# EAGLE design CorrienteTestMaquina (EAGLE 9.6.2)
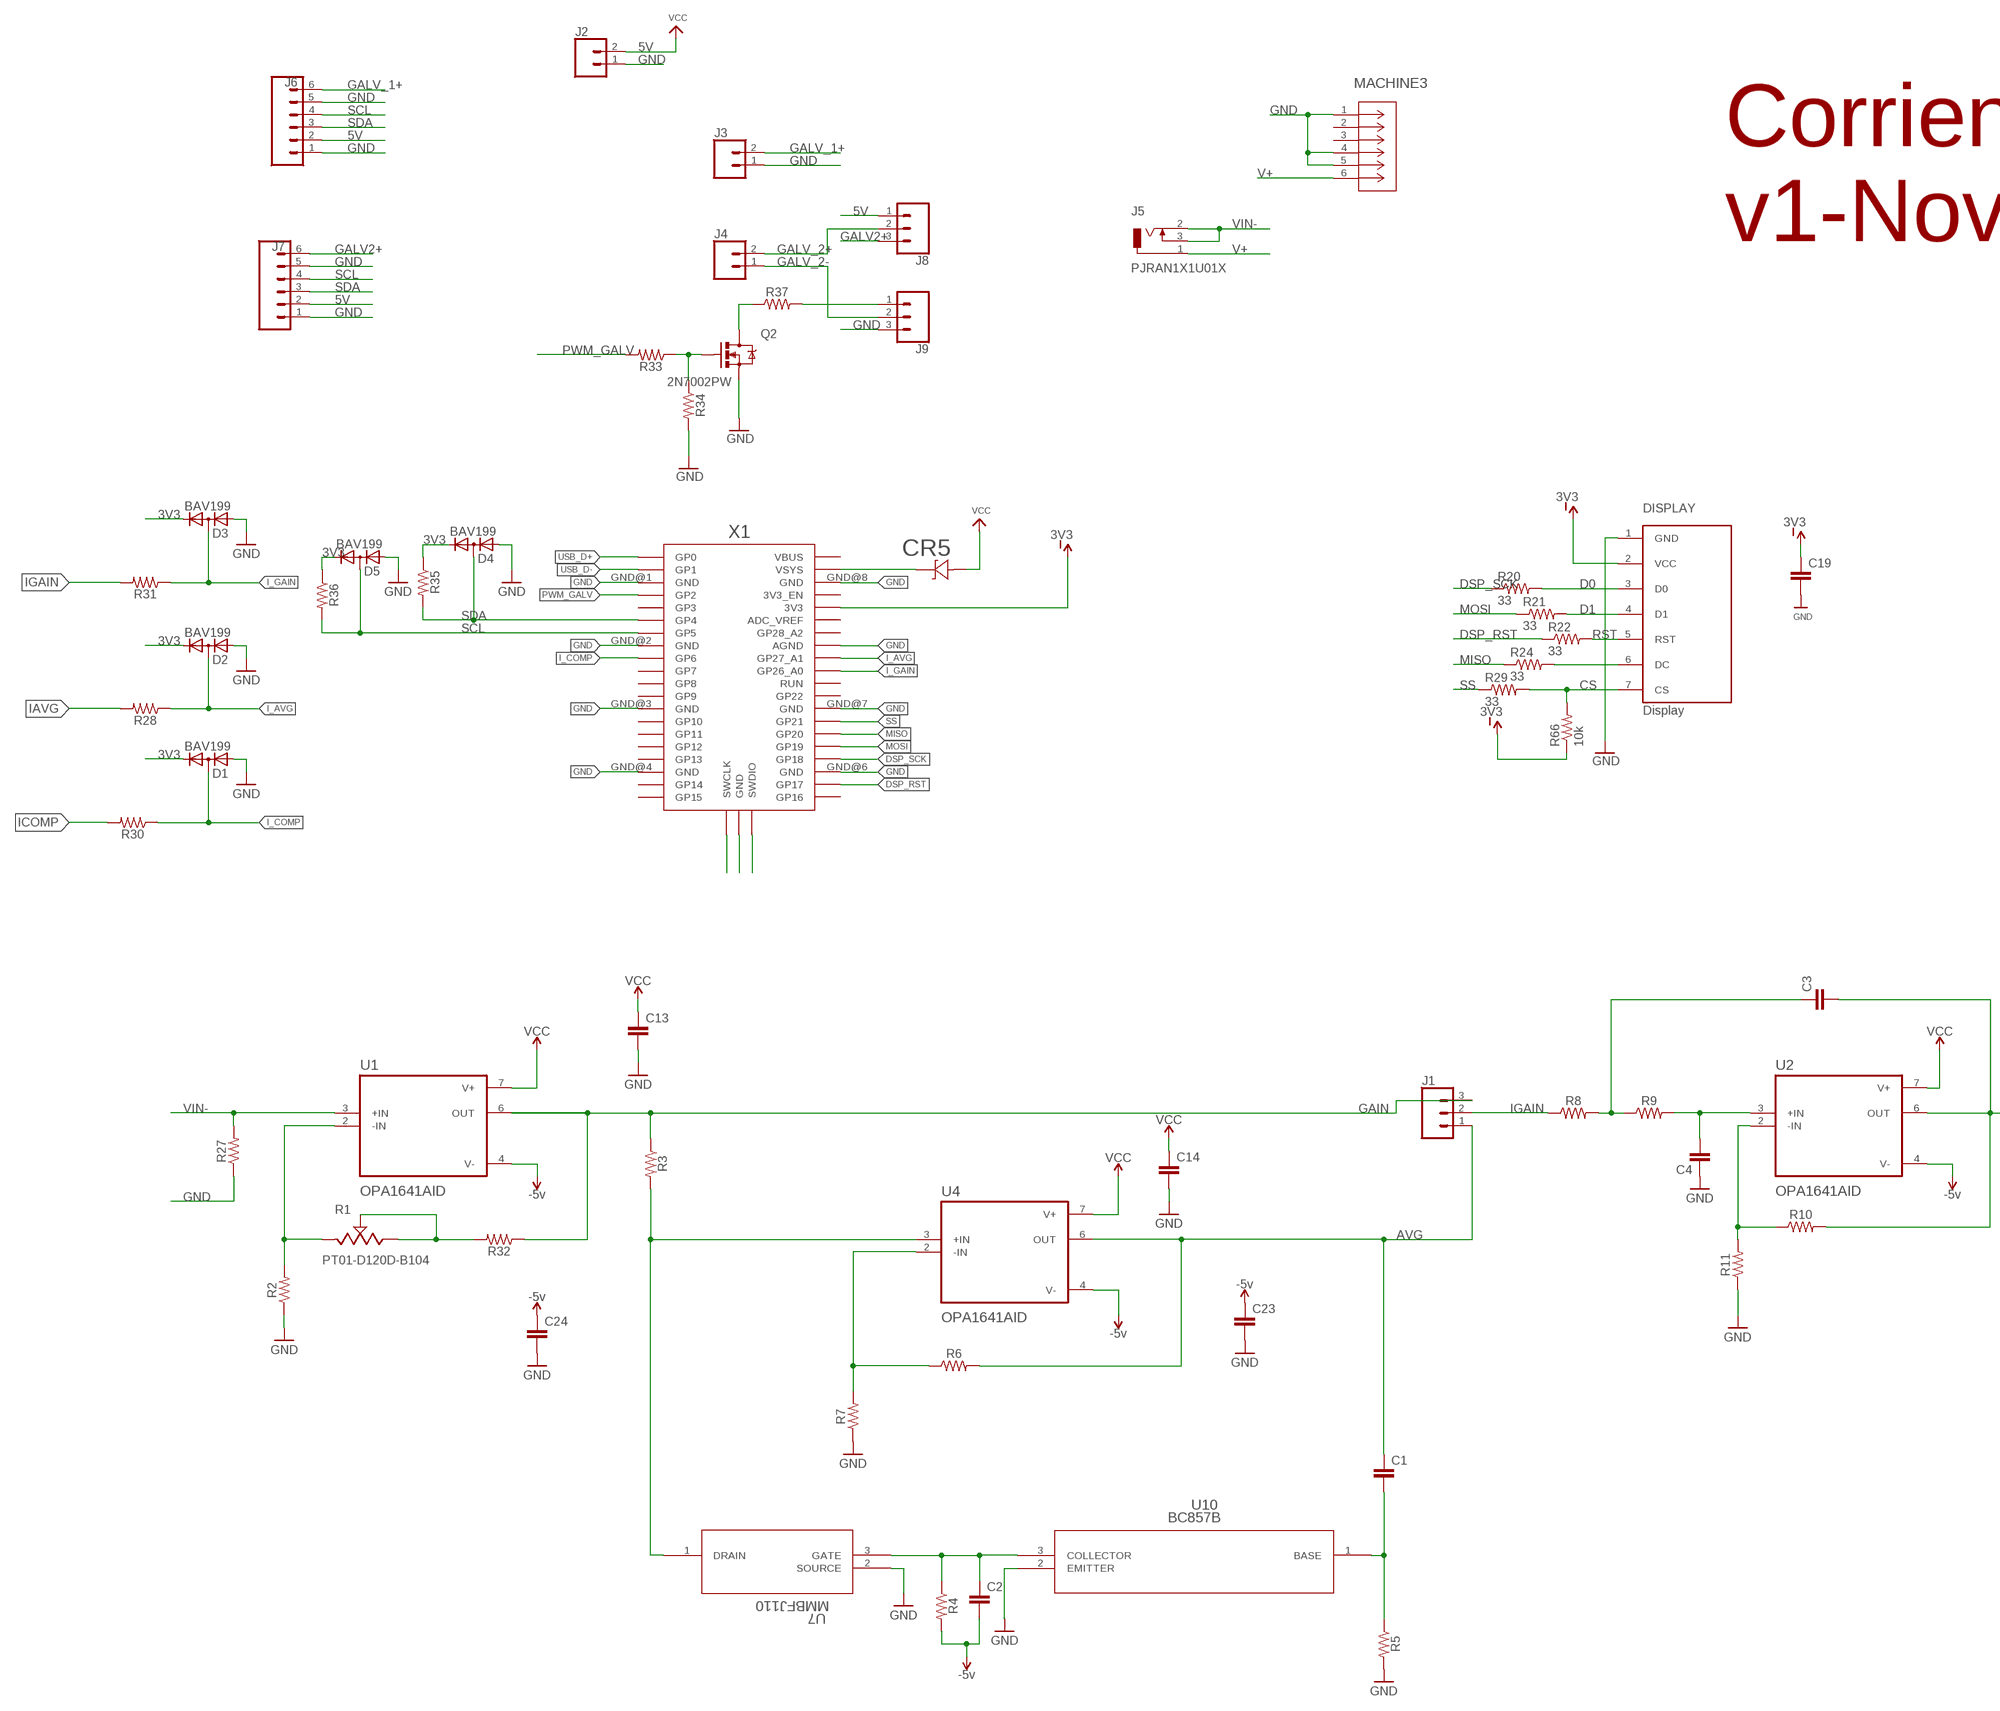
[diagram p0: schematic, sheet 1, part 1 of 2]
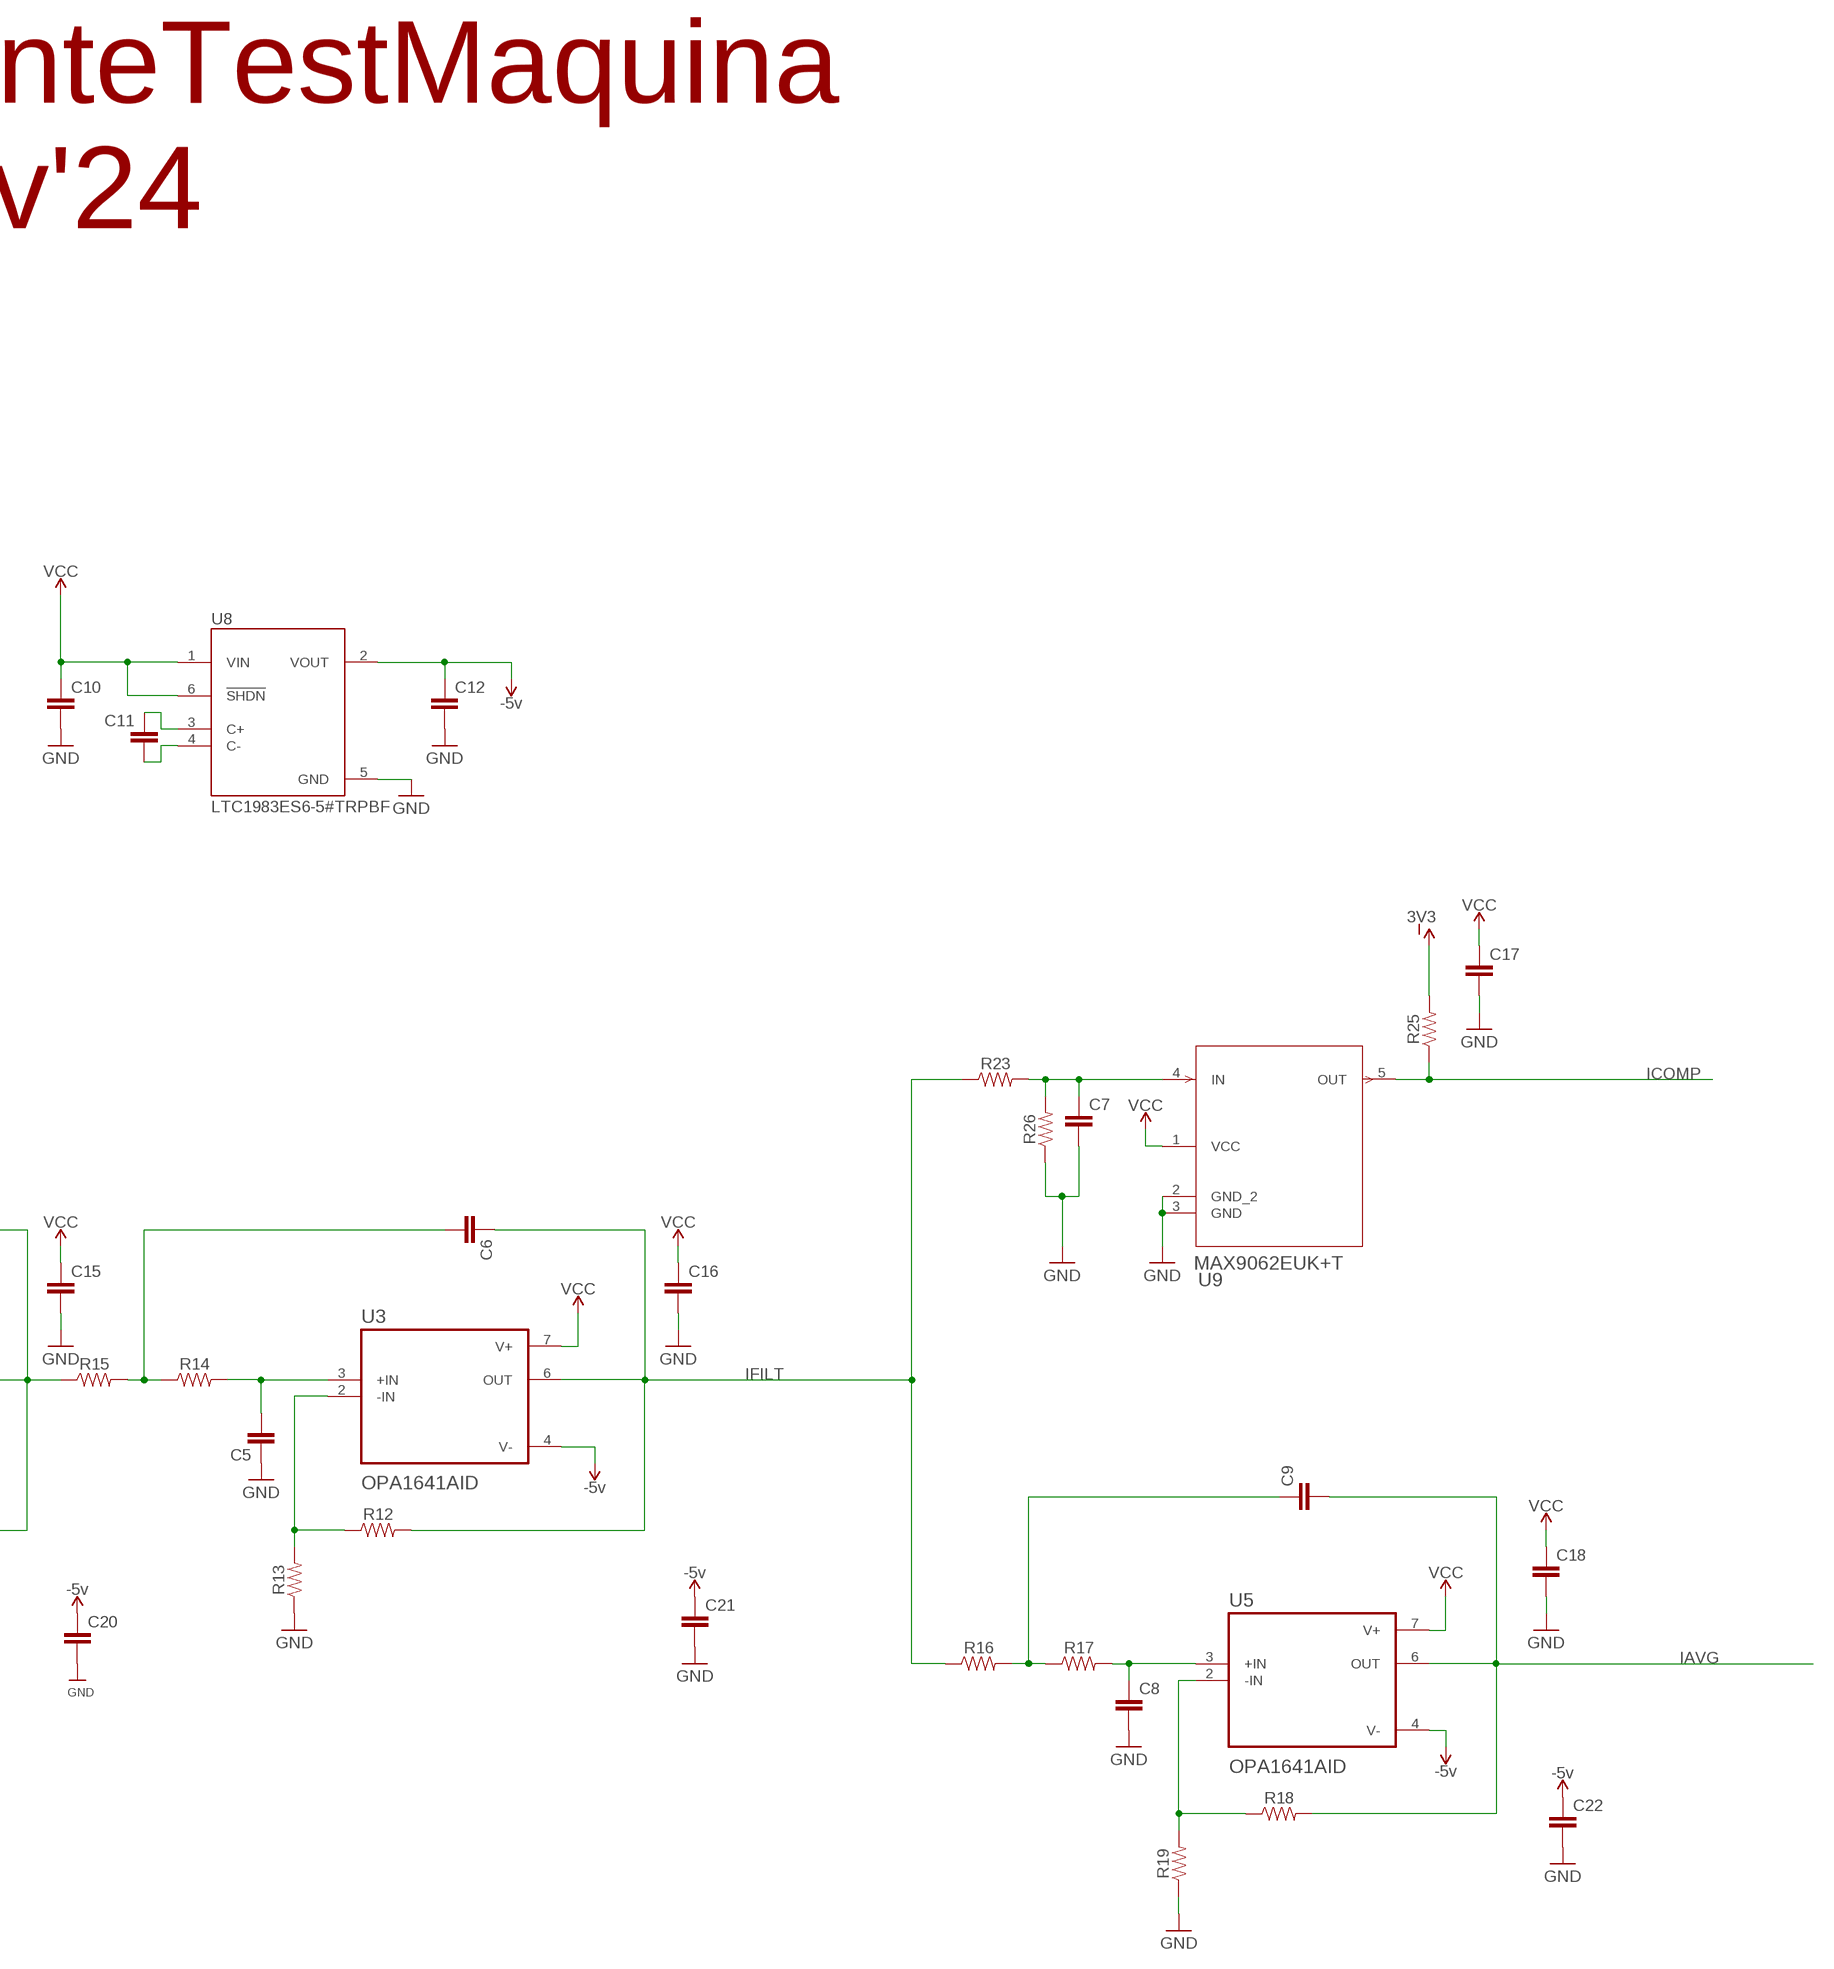
[diagram p1: schematic, sheet 1, part 2 of 2]

## Parts
C1  CAP0805  [0805]
C2  CAP0805  [0805]
C3  CAP0805  [0805]
C4  CAP0805  [0805]
C5  CAP0805  [0805]
C6  CAP0805  [0805]
C7  CAP0805  [0805]
C8  CAP0805  [0805]
C9  CAP0805  [0805]
C10  CAP0805  [0805]
C11  CAP0805  [0805]
C12  CAP0805  [0805]
C13  CAP0805  [0805]
C14  CAP0805  [0805]
C15  CAP0805  [0805]
C16  CAP0805  [0805]
C17  CAP0805  [0805]
C18  CAP0805  [0805]
C19  CAP0805  [0805]
C20  CAP0805  [0805]
C21  CAP0805  [0805]
C22  CAP0805  [0805]
C23  CAP0805  [0805]
C24  CAP0805  [0805]
CR5  STPS1L40U  [SMB_STM]
D1  BAV199  [SOT23]
D2  BAV199  [SOT23]
D3  BAV199  [SOT23]
D4  BAV199  [SOT23]
D5  BAV199  [SOT23]
DISPLAY  Display  OLED_LCD  [OLED_LCD]
J1  CONN_03  [1X03]
J2  CONN_02  [1X02]
J3  CONN_02  [1X02]
J4  CONN_02  [1X02]
J5  PJRAN1X1U01X  [PJRAN1X1U01X]
J6  CONN_06SILK_FEMALE_PTH  [1X06]
J7  CONN_06SILK_FEMALE_PTH  [1X06]
J8  CONN_03  [1X03]
J9  CONN_03  [1X03]
MACHINE3  ACJS-MHDR  [CONN_MHDR_AMP]
Q2  2N7002PW  MOSFET-NCHANNEL2N7002PW  [SOT323]
R1  PT01-D120D-B104  [TRIM_PT01-D120D-B104]
R2  RESISTOR0805  [0805]
R3  RESISTOR0805  [0805]
R4  RESISTOR0805  [0805]
R5  RESISTOR0805  [0805]
R6  RESISTOR0805  [0805]
R7  RESISTOR0805  [0805]
R8  RESISTOR0805  [0805]
R9  RESISTOR0805  [0805]
R10  RESISTOR0805  [0805]
R11  RESISTOR0805  [0805]
R12  RESISTOR0805  [0805]
R13  RESISTOR0805  [0805]
R14  RESISTOR0805  [0805]
R15  RESISTOR0805  [0805]
R16  RESISTOR0805  [0805]
R17  RESISTOR0805  [0805]
R18  RESISTOR0805  [0805]
R19  RESISTOR0805  [0805]
R20  33  RESISTOR0805  [0805]
R21  33  RESISTOR0805  [0805]
R22  33  RESISTOR0805  [0805]
R23  RESISTOR0805  [0805]
R24  33  RESISTOR0805  [0805]
R25  RESISTOR0805  [0805]
R26  RESISTOR0805  [0805]
R27  RESISTOR1206  [1206]
R28  RESISTOR0805  [0805]
R29  33  RESISTOR0805  [0805]
R30  RESISTOR0805  [0805]
R31  RESISTOR0805  [0805]
R32  RESISTOR0805  [0805]
R33  RESISTOR0805  [0805]
R34  RESISTOR0805  [0805]
R35  RESISTOR0805  [0805]
R36  RESISTOR0805  [0805]
R37  RESISTOR0805  [0805]
R66  10k  RESISTOR0805  [0805]
U1  OPA1641AID  [SOIC127P599X175-8N]
U2  OPA1641AID  [SOIC127P599X175-8N]
U3  OPA1641AID  [SOIC127P599X175-8N]
U4  OPA1641AID  [SOIC127P599X175-8N]
U5  OPA1641AID  [SOIC127P599X175-8N]
U7  MMBFJ110  [SSOT3_3X1P5_ONS]
U8  LTC1983ES6-5#TRPBF  [SOT95P280X100-6N]
U9  MAX9062EUK+T  [21-0057F_MXM]
U10  BC857B  [SOT23_NXP]
X1  RPI_PICO_IG-TH  [RPI_PICO_TH]

## Nets
3V3: C19.1 D1.2(C) D2.2(C) D3.2(C) D4.2(C) D5.2(C) DISPLAY.2(VCC) R25.2 R35.1 R36.1 R66.1 X1.3V3
5V: C10.1 C13.1 C14.1 C15.1 C16.1 C17.1 C18.1 CR5.1 J2.2 J6.2 J7.2 J8.1 U1.7(V+) U2.7(V+) U3.7(V+) U4.7(V+) U5.7(V+) U8.1(VIN) U8.6(!SHDN) U9.1(VCC) ; supply symbol labelled VCC
-5V: C2.2 C12.1 C20.1 C21.1 C22.1 C23.1 C24.1 R4.2 U1.4(V-) U2.4(V-) U3.4(V-) U4.4(V-) U5.4(V-) U8.2(VOUT) ; supply symbol labelled -5v
AVG: C1.1 J1.1 R6.2 U4.6(OUT)
CS: DISPLAY.7(CS) R29.2 R66.2
D0: DISPLAY.3(D0) R20.2
D1: DISPLAY.4(D1) R21.2
DSP_RST: R22.1 X1.GP17
DSP_SCK: R20.1 X1.GP18
GAIN: J1.3 R3.1 R32.1 U1.6(OUT)
GALV2+: J7.6 J8.3
GALV_1+: J3.2 J6.6
GALV_2+: J4.2 J8.2
GALV_2-: J4.1 J9.2
GND: C4.1 C5.1 C7.2 C8.2 C10.2 C12.2 C13.2 C14.2 C15.2 C16.2 C17.2 C18.2 C19.2 C20.2 C21.2 C22.2 C23.2 C24.2 D1.1(A) D2.1(A) D3.1(A) D4.1(A) D5.1(A) DISPLAY.1(GND) J2.1 J3.1 J6.1 J6.5 J7.1 J7.5 J9.3 MACHINE3.1 MACHINE3.4 MACHINE3.5 Q2.2(S) R2.1 R5.2 R7.1 R11.1 R13.1 R19.1 R26.1 R27.1 R34.2 U7.2(SOURCE) U8.5(GND) U9.2(GND_2) U9.3(GND) U10.2(EMITTER) X1.AGND X1.GND@1(GND) X1.GND@2(GND) X1.GND@3(GND) X1.GND@4(GND) X1.GND@6(GND) X1.GND@7(GND) X1.GND@8(GND)
I_AVG: D2.3(AC) R28.1 X1.GP27_A1
I_COMP: D1.3(AC) R30.1 X1.GP6
I_GAIN: D3.3(AC) R31.1 X1.GP26_A0
IAVG: C9.2 R18.2 R28.2 U5.6(OUT)
ICOMP: R25.1 R30.2 U9.5(OUT)
IFILT: C6.1 R12.2 R16.1 R23.1 U3.6(OUT)
IGAIN: J1.2 R8.1 R31.2
MISO: R24.1 X1.GP20
MOSI: R21.1 X1.GP19
N$1: Q2.1(G) R33.1 R34.1
N$2: R1.1 R2.2 U1.2(-IN)
N$3: J9.1 R37.2
N$4: C2.1 R4.1 U7.3(GATE) U10.3(COLLECTOR)
N$5: C1.2 R5.1 U10.1(BASE)
N$6: Q2.3(D) R37.1
N$7: DISPLAY.6(DC) R24.2
N$8: R6.1 R7.2 U4.2(-IN)
N$9: C3.1 R8.2 R9.1
N$10: C4.2 R9.2 U2.3(+IN)
N$11: R10.1 R11.2 U2.2(-IN)
N$12: C3.2 R10.2 R15.1 U2.6(OUT)
N$13: C6.2 R14.1 R15.2
N$14: C5.2 R14.2 U3.3(+IN)
N$15: R12.1 R13.2 U3.2(-IN)
N$16: R1.2 R1.3 R32.2
N$17: C8.1 R17.2 U5.3(+IN)
N$18: C9.1 R16.2 R17.1
N$20: R18.1 R19.2 U5.2(-IN)
N$21: C7.1 R23.2 R26.2 U9.4(IN)
N$22: R3.2 U4.3(+IN) U7.1(DRAIN)
N$27: C11.1 U8.3(C+)
N$28: C11.2 U8.4(C-)
N$45: X1.SWCLK
N$46: X1.GND@5(GND)
N$47: X1.SWDIO
N$75: CR5.2 X1.VSYS
PWM_GALV: R33.2 X1.GP2
RST: DISPLAY.5(RST) R22.2
SCL: D5.3(AC) J6.4 J7.4 R36.2 X1.GP5
SDA: D4.3(AC) J6.3 J7.3 R35.2 X1.GP4
SS: R29.1 X1.GP21
USB_D+: X1.GP0
USB_D-: X1.GP1
V+: J5.1 MACHINE3.6
VIN-: J5.2 J5.3 R27.2 U1.3(+IN)
Unconnected: MACHINE3.2 MACHINE3.3 X1.3V3_EN X1.ADC_VREF X1.GP3 X1.GP7 X1.GP8 X1.GP9 X1.GP10 X1.GP11 X1.GP12 X1.GP13 X1.GP14 X1.GP15 X1.GP16 X1.GP22 X1.GP28_A2 X1.RUN X1.VBUS

## Notes on the sheet
- CorrienteTestMaquina
  v1-Nov'24

## Library data of the parts
C1-C24 = SparkFun-Passives:CAP: Capacitor Standard 0603 ceramic capacitor, and 0.1" leaded capacitor.
CR5 = STPS1L40U:STPS1L40U; COPYRIGHT: Copyright (C) 2024 Ultra Librarian. All rights reserved.; MANUFACTURER_PART_NUMBER: STPS1L40U; MFR_NAME: STMicroelectronics
D1-D5 = diode:BAV199: DIODE low-leakage double diode
DISPLAY = EDCPSU:OLED_LCD
J1 J8 J9 = SparkFun-Connectors:CONN_03: Multi connection point. Often used as Generic Header-pin footprint for 0.1 inch spaced/style header connections On any of the 0.1 inch spaced packages, you can populate with these: Break Away Headers - Straight <https://www.sparkfun.com/products/116> (PRT-00116) Break Away Male Headers - Right Angle <https://www.sparkfun.com/products/553> (PRT-00553) Female Headers <https://www.sparkfun.com/products/115> (PRT-00115) Break Away Headers - Machine Pin <https://www.sparkfun.com/products/117> (PRT-00117) Break Away Female Headers - Swiss Machine Pin <https://www.sparkfun.com/products/743> (PRT-00743) Stackable Header - 3 Pin (Female, 0.1") <https://www.sparkfun.com/products/13875> (PRT-13875) For SCREWTERMINALS and SPRING TERMINALS visit here: Screw Terimnals on SparkFun.com <https://www.sparkfun.com/search/results?term=Screw+Terminals> (5mm/3.5mm/2.54mm spacing) This device is also useful as a general connection point to wire up your design to another part of your project. Our various solder wires solder well into these plated through hole pads. Hook-Up Wire - Assortment (Stranded, 22 AWG) <https://www.sparkfun.com/products/11375> (PRT-11375) Hook-Up Wire - Assortment (Solid Core, 22 AWG) <https://www.sparkfun.com/products/11367> (PRT-11367) View the entire wire category on our website here <https://www.sparkfun.com/categories/141> Special notes: Molex polarized connector foot print use with SKU : PRT-08232 with associated crimp pins and housings.
J2-J4 = SparkFun-Connectors:CONN_02: Multi connection point. Often used as Generic Header-pin footprint for 0.1 inch spaced/style header connections On any of the 0.1 inch spaced packages, you can populate with these: Break Away Headers - Straight <https://www.sparkfun.com/products/116> (PRT-00116) Break Away Male Headers - Right Angle <https://www.sparkfun.com/products/553> (PRT-00553) Female Headers <https://www.sparkfun.com/products/115> (PRT-00115) Break Away Headers - Machine Pin <https://www.sparkfun.com/products/117> (PRT-00117) Break Away Female Headers - Swiss Machine Pin <https://www.sparkfun.com/products/743> (PRT-00743) For SCREWTERMINALS and SPRING TERMINALS visit here: Screw Terimnals on SparkFun.com <https://www.sparkfun.com/search/results?term=Screw+Terminals> (5mm/3.5mm/2.54mm spacing) This device is also useful as a general connection point to wire up your design to another part of your project. Our various solder wires solder well into these plated through hole pads. Hook-Up Wire - Assortment (Stranded, 22 AWG) <https://www.sparkfun.com/products/11375> (PRT-11375) Hook-Up Wire - Assortment (Solid Core, 22 AWG) <https://www.sparkfun.com/products/11367> (PRT-11367) View the entire wire category on our website here <https://www.sparkfun.com/categories/141> Special notes: Molex polarized connector foot print use with: PRT-08233 with associated crimp pins and housings. 2.54_SCREWTERM for use with PRT-10571. 3.5mm Screw Terminal footprints for PRT-08084 5mm Screw Terminal footprints for use with PRT-08432
J5 = Connectors:PJRAN1X1U01X: CONN RCA JACK MONO 3.2MM R/A Manufacturer's datasheet <http://www.switchcraft.com/Drawings/pjran1x1u__x_series_cd.pdf>; CREATED_BY: PCBLayout.com; DIGIKEY_PART_NUMBER: PJRAN1X1U01X-ND; MANUFACTURER: Switchcraft Inc.; MPN: PJRAN1X1U01X
J6 J7 = SparkFun-Connectors:CONN_06: Multi connection point. Often used as Generic Header-pin footprint for 0.1 inch spaced/style header connections On any of the 0.1 inch spaced packages, you can populate with these: Break Away Headers - Straight <https://www.sparkfun.com/products/116> (PRT-00116) Break Away Male Headers - Right Angle <https://www.sparkfun.com/products/553> (PRT-00553) Female Headers <https://www.sparkfun.com/products/115> (PRT-00115) Break Away Headers - Machine Pin <https://www.sparkfun.com/products/117> (PRT-00117) Break Away Female Headers - Swiss Machine Pin <https://www.sparkfun.com/products/743> (PRT-00743) Arduino Stackable Header - 6 Pin <https://www.sparkfun.com/products/9280> (PRT-09280) For SCREWTERMINALS and SPRING TERMINALS visit here: Screw Terimnals on SparkFun.com <https://www.sparkfun.com/search/results?term=Screw+Terminals> (5mm/3.5mm/2.54mm spacing) This device is also useful as a general connection point to wire up your design to another part of your project. Our various solder wires solder well into these plated through hole pads. Hook-Up Wire - Assortment (Stranded, 22 AWG) <https://www.sparkfun.com/products/11375> (PRT-11375) Hook-Up Wire - Assortment (Solid Core, 22 AWG) <https://www.sparkfun.com/products/11367> (PRT-11367) View the entire wire category on our website here <https://www.sparkfun.com/categories/141>; PROD_ID: CONN-08437
MACHINE3 = ACJSMHDR:ACJS-MHDR; BUILT_BY: EMA_Matt; COPYRIGHT: Copyright (C) 2018 Accelerated Designs. All rights reserved; MANUFACTURER_PART_NUMBER: ACJS-MHDR; SOURCELIBRARY: Amphenol_2019-10-30; VENDOR: Amphenol
Q2 = SparkFun-DiscreteSemi:MOSFET-NCHANNEL: Common NMOSFET Parts MFG P/N Store ID Prod ID FDD8780 TRANS-09984 SI7820DN TRANS-11055 FDS6630A IC-08089 2N7002PW TRANS-11151 FQP30N06L COM-10213 TRANS-10060 BSS123LT1G TRANS-08345 BSS138 TRANS-00830 BS170 2N7000; PROD_ID: TRANS-11151
R1 = PT01-D120D-B104:PT01-D120D-B104; MANUFACTURER: CUI Devices; MAXIMUM_PACKAGE_HEIGHT: 26.8 mm; PARTREV: 1.0; STANDARD: Manufacturer Recommendations
R2-R37 R66 = SparkFun-Resistors:RESISTOR: Generic Resistor Package
U1-U5 = OPA1641AID:OPA1641AID
U7 = MMBFJ110:MMBFJ110; COPYRIGHT: Copyright (C) 2024 Ultra Librarian. All rights reserved.; MANUFACTURER_PART_NUMBER: MMBFJ110; MFR_NAME: onsemi
U8 = LTC1983ES6-5_TRPBF:LTC1983ES6-5#TRPBF: Charge Pump INV -5V/-2.3V to -5.5V 100mA 6-Pin TSOT-23 T/R; MANUFACTURER: LINEAR TECHNOLOGY; PARTREV: C; STANDARD: IPC 7351B
U9 = MAX9062:MAX9062EUK+T; BUILT_BY: EMA_UL_Team; MANUFACTURER_PART_NUMBER: MAX9062EUK+T; SOURCELIBRARY: Maxim_2014-06-20; VENDOR: Maxim Integrated Products
U10 = BC857B:BC857B; COPYRIGHT: Copyright (C) 2024 Ultra Librarian. All rights reserved.; DIGIKEY_PART_NUMBER_1: 568-8009-2-ND; DIGIKEY_PART_NUMBER_10: 497-2526-1-ND; DIGIKEY_PART_NUMBER_11: 497-2526-2-ND; DIGIKEY_PART_NUMBER_2: 568-8009-1-ND; DIGIKEY_PART_NUMBER_3: 568-8009-6-ND; DIGIKEY_PART_NUMBER_4: 568-1638-2-ND; DIGIKEY_PART_NUMBER_5: 568-1638-1-ND; DIGIKEY_PART_NUMBER_6: 568-1638-6-ND; DIGIKEY_PART_NUMBER_7: 2156-BC857B-ITTR-ND; DIGIKEY_PART_NUMBER_8: 2721-BC857B-ND; DIGIKEY_PART_NUMBER_9: 2796-BC857BTR-ND; MANUFACTURER_PART_NUMBER: BC857B; MFR_NAME: NXP
X1 = RaspberryPi_Pico:RPI_PICO_IG

## Board
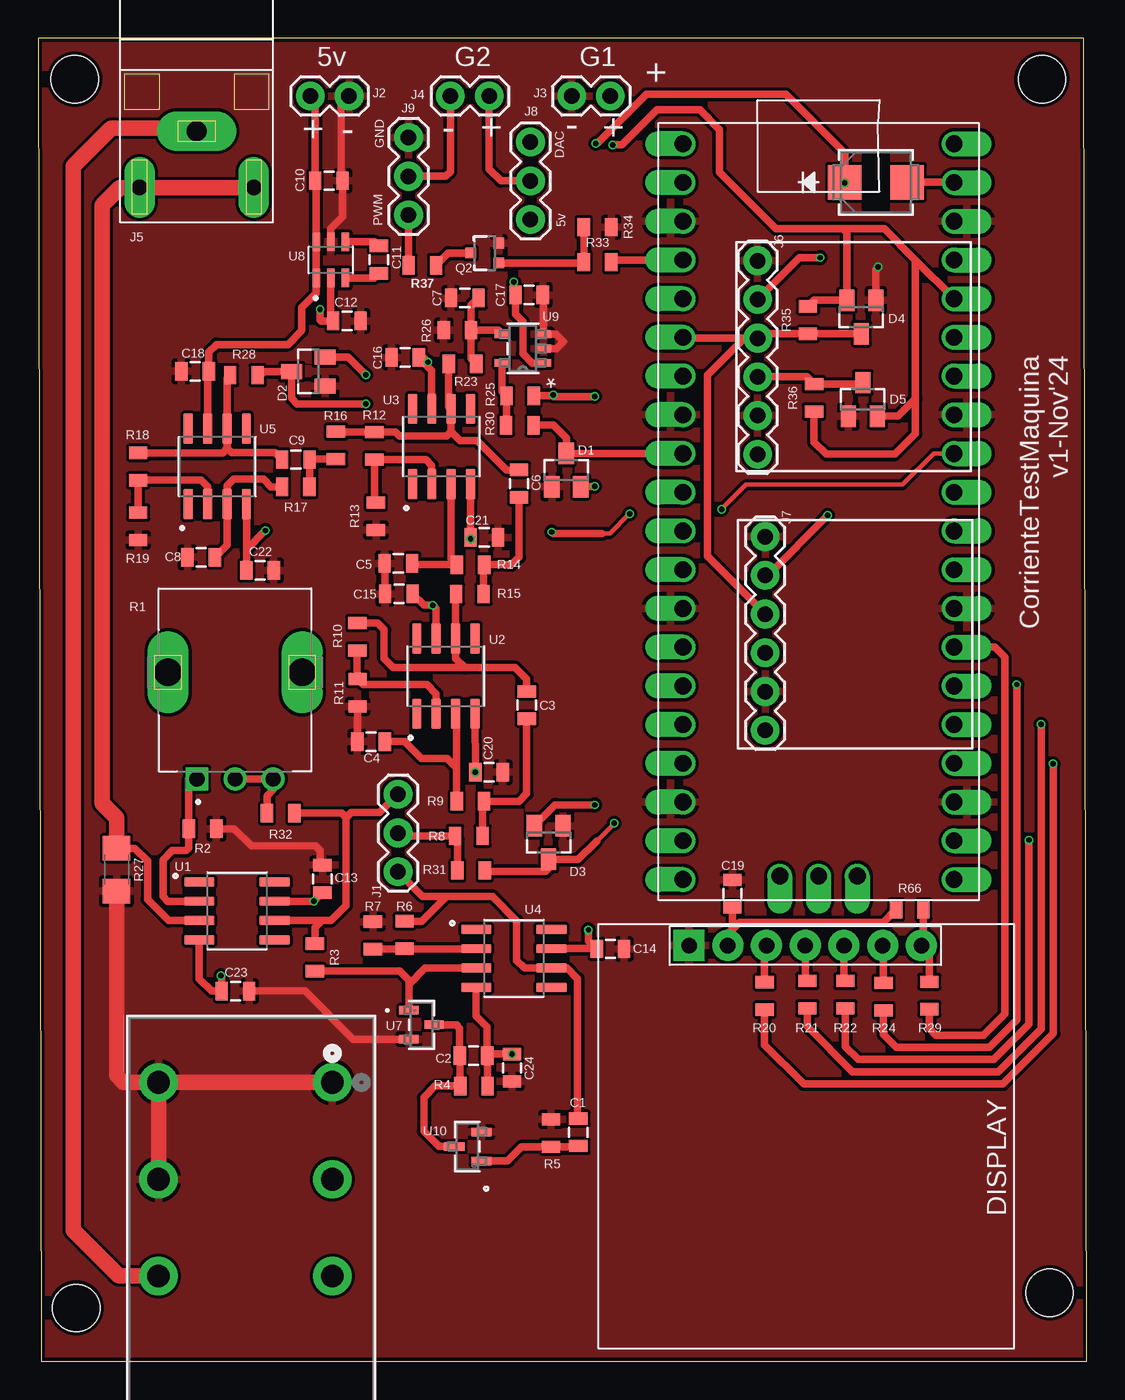
[diagram p2: board, top side]
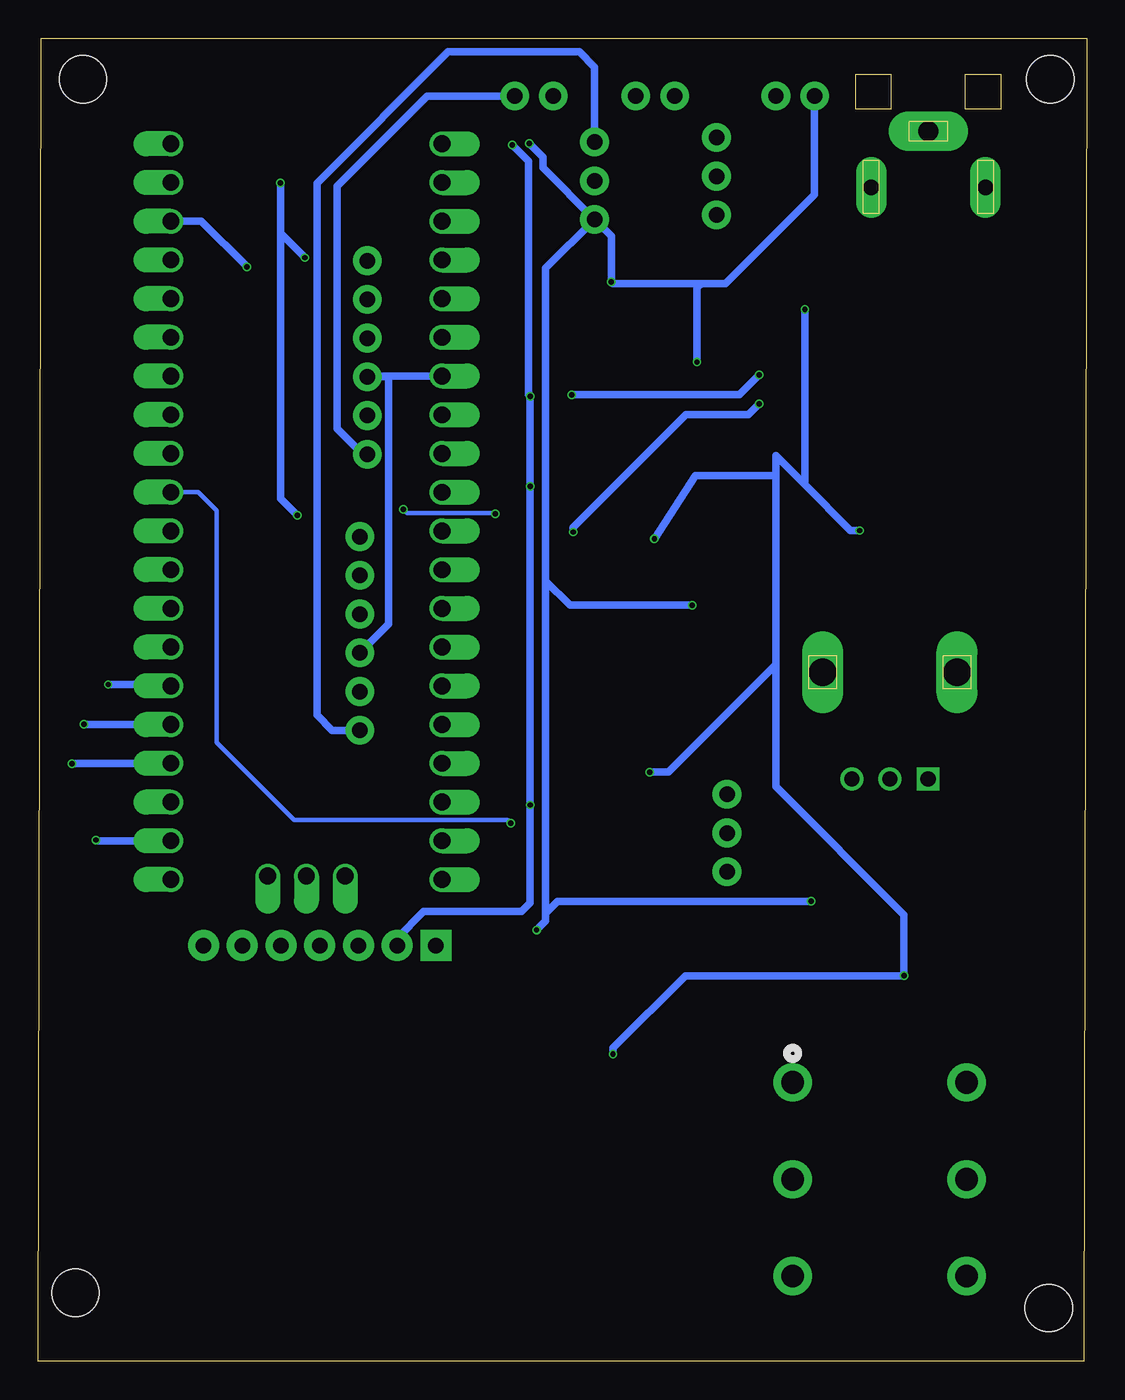
[diagram p3: board, bottom side, seen from below]

Size 68.8 x 86.8 mm. Coordinates in mm from the lower left corner, seen from the top.
Outline: 0.2,0 68.8,0 68.6,86.8 0,86.8 0.2,0
Copper layers (1*16): Top 0.035mm / dielectric 1.5mm / Bottom 0.035mm
Design rules "default *": minimum track width 6mil, minimum drill 0.35mm, track to track 8mil, track to pad 8mil, pad to pad 8mil, via to via 8mil, smd to smd 0mil, copper to edge 10mil, drill to drill 8mil, minimum pad ring 6mil, minimum via ring 4mil, stop-mask expansion 4mil, vias tented up to drill 25mil, thermal gap 10mil
Holes 3.1 mm at 2.5,3.5 2.41,84.11 66.36,4.5 65.86,84.11

### Footprints (pad centres in the part's own frame; a part is rotated, then mirrored left to right if it is on the bottom)
0805 = smd 0.8 x 1.2: 1 -0.9,0; 2 0.9,0
SMB_STM = smd 2.21 x 2.261: 1 -2.045,0; 2 2.045,0
SOT23 = smd 1 x 1.4: 1 -0.95,-1.1; 2 0.95,-1.1; 3 0,1.1
OLED_LCD = drill 1.016 pad 2.032 square: 1 -7.42,13.7 | drill 1.016 pad 2.032: 2 -4.88,13.7; 3 -2.34,13.7; 4 0.2,13.7; 5 2.74,13.7; 6 5.28,13.7; 7 7.82,13.7
1X03 = drill 1.016 pad 1.88: 1 0,0; 2 2.54,0; 3 5.08,0
1X02 = drill 1.016 pad 1.88: 1 0,0; 2 2.54,0
PJRAN1X1U01X = drill 1.3 pad 2.6 long: 1 0,0 | drill 1 pad 2 long: 2 3.75,3.7; 3 -3.75,3.7
1X06 = drill 1.016 pad 1.88: 1 0,0; 2 2.54,0; 3 5.08,0; 4 7.62,0; 5 10.16,0; 6 12.7,0
CONN_MHDR_AMP = drill 1.5 pad 2.5: 1 0,0; 2 -6.35,0; 3 -12.7,0; 4 0,11.405; 5 -6.35,11.405; 6 -12.7,11.405
SOT323 = smd 0.7 x 0.7: 1 -0.65,-0.925; 2 0.65,-0.925; 3 0,0.925
TRIM_PT01-D120D-B104 = drill 1 square: 1 -2.5,-7 | drill 1: 2 0,-7; 3 2.5,-7 | drill 1.8 pad 2.3 long: S1 -4.4,0; S2 4.4,0
1206 = smd 1.6 x 1.8: 1 -1.4,0; 2 1.4,0
SOIC127P599X175-8N = smd 1.97 x 0.6: 1 -2.47,1.905; 2 -2.47,0.635; 3 -2.47,-0.635; 4 -2.47,-1.905; 5 2.47,-1.905; 6 2.47,-0.635; 7 2.47,0.635; 8 2.47,1.905
SSOT3_3X1P5_ONS = smd 0.559 x 1.27: 1 -0.953,-0.826; 2 0.953,-0.826; 3 0,0.826
SOT95P280X100-6N = smd 1.24 x 0.55: 1 -1.185,0.95; 2 -1.185,0; 3 -1.185,-0.95; 4 1.185,-0.95; 5 1.185,0; 6 1.185,0.95
21-0057F_MXM = smd 0.972 x 0.508: 1 -1.362,0.95; 2 -1.362,0; 3 -1.362,-0.95; 4 1.362,-0.95; 5 1.362,0.95
SOT23_NXP = smd 0.559 x 1.321: 1 -0.953,-0.945; 2 0.953,-0.945; 3 0,0.847
RPI_PICO_TH = drill 1.1 pad 1.6 offset: 3V3 8.89,13.97; 3V3_EN 8.89,16.51; ADC_VREF 8.89,11.43; AGND 8.89,6.35; GND@1 -8.89,19.05; GND@2 -8.89,6.35; GND@3 -8.89,-6.35; GND@4 -8.89,-19.05; GND@5 0,-23.9; GND@6 8.89,-19.05; GND@7 8.89,-6.35; GND@8 8.89,19.05; GP0 -8.89,24.13; GP1 -8.89,21.59; GP2 -8.89,16.51; GP3 -8.89,13.97; GP4 -8.89,11.43; GP5 -8.89,8.89; GP6 -8.89,3.81; GP7 -8.89,1.27; GP8 -8.89,-1.27; GP9 -8.89,-3.81; GP10 -8.89,-8.89; GP11 -8.89,-11.43; GP12 -8.89,-13.97; GP13 -8.89,-16.51; GP14 -8.89,-21.59; GP15 -8.89,-24.13; GP16 8.89,-24.13; GP17 8.89,-21.59; GP18 8.89,-16.51; GP19 8.89,-13.97; GP20 8.89,-11.43; GP21 8.89,-8.89; GP22 8.89,-3.81; GP26_A0 8.89,1.27; GP27_A1 8.89,3.81; GP28_A2 8.89,8.89; RUN 8.89,-1.27; SWCLK -2.54,-23.9; SWDIO 2.54,-23.9; VBUS 8.89,24.13; VSYS 8.89,21.59

### Placement (x,y rotation side)
C1  35.44,15.03 270 top
C2  28.56,20.05 0 top
C3  32.05,43.05 90 top
C4  21.84,40.65 0 top
C5  23.63,52.35 0 top
C6  31.55,57.58 270 top
C7  27.99,69.75 180 top
C8  10.7,52.75 180 top
C9  16.91,59.15 180 top
C10  19.08,77.45 0 top
C11  22.35,72.27 90 top
C12  20.26,68.25 0 top
C13  18.65,31.65 90 top
C14  37.54,27.05 0 top
C15  23.67,50.35 180 top
C16  24.08,65.85 180 top
C17  32.21,69.95 0 top
C18  10.3,64.95 180 top
C19  45.55,30.69 90 top
C20  29.58,38.65 0 top
C21  29.27,54.05 0 top
C22  14.56,51.89 0 top
C23  12.95,24.29 0 top
C24  31.09,19.26 270 top
CR5  54.96,77.34 0 top
D1  34.65,58.47 0 top
D2  17.73,64.93 90 top
D3  33.49,34.03 180 top
D4  54,68.5 180 top
D5  54.1,63.1 0 top
DISPLAY  50.13,13.57 0 top
J1  23.61,32.12 90 top
J2  20.4,83 180 top
J3  35,83 0 top
J4  27.05,83 0 top
J5  10.4,80.7 180 top
J6  47.2,72.2 270 top
J7  47.7,54.1 270 top
J8  32.3,74.9 90 top
J9  24.3,75.2 90 top
MACHINE3  19.3,18.3 90 top
Q2  29.3,72.7 90 top
R1  12.92,45.2 0 top
R2  10.79,34.94 180 top
R3  18.16,26.5 270 top
R4  28.59,18.06 0 top
R5  33.64,14.98 90 top
R6  24.04,27.97 90 top
R7  21.96,27.94 270 top
R8  28.25,34.46 0 top
R9  28.36,36.74 180 top
R10  20.94,47.53 90 top
R11  20.96,43.86 90 top
R12  22.06,60.05 90 top
R13  22.16,55.44 90 top
R14  28.37,52.26 180 top
R15  28.32,50.34 0 top
R16  19.54,60.09 270 top
R17  16.9,57.36 180 top
R18  6.56,58.69 90 top
R19  6.56,54.78 90 top
R20  47.66,23.97 90 top
R21  50.46,24.06 90 top
R22  52.96,24.05 90 top
R23  27.84,65.44 0 top
R24  55.46,23.93 90 top
R25  31.62,63.34 0 top
R26  27.51,67.64 0 top
R27  5.14,32.25 90 top
R28  13.5,64.7 180 top
R29  58.46,24 90 top
R30  31.6,61.4 180 top
R31  28.4,32.2 180 top
R32  15.91,35.96 180 top
R33  36.7,72.1 0 top
R34  36.7,74.4 0 top
R35  50.5,68.3 270 top
R36  50.9,63.2 90 top
R37  25.2,71.9 180 top
R66  57.18,29.64 0 top
U1  13.05,29.55 0 top
U2  26.75,44.95 90 top
U3  26.46,60.01 90 top
U4  31.21,26.44 0 top
U5  11.76,58.71 90 top
U7  25.15,22.08 270 top
U8  19.2,72.25 90 top
U9  31.8,66.44 180 top
U10  28.15,14.1 90 top
X1  51.2,55.74 0 top

### Tracks (layer width: path | path; a pad name or v marks a point on that pad's centre or on a via)
3V3  (via drill 0.35)
  Top 0.508: v21.5,64.7 20.32,65.88 D2.2 | R25.2 33.74,63.34 v33.8,63.4 33.8,63.3 v36.52,63.3 | X1.3V3 57.55,72.25 | 57.55,72.25 55.5,74.3 52.8,74.3 | 52.8,74.3 48.4,74.3 44.7,78 44.7,80.8 43.4,82.1 40.6,82.1 38.3,79.8 v37.7,79.8 | 52.8,74.3 53.05,74.05 D4.2 50.9,69.6 R35.1 | 57.55,63.15 57.55,72.25 | 57.55,63.15 56.4,62 D5.2 | 57.55,63.15 57.55,60.85 56.2,59.5 51.7,59.5 50.9,60.3 R36.1 | R66.1 55.44,28.8 46,28.8 45.25,28.05 DISPLAY.2 45.55,27.57 C19.1 | D3.2 33.91,36.5 v36.52,36.5 | v36.52,57.4 36.49,57.37 D1.2
  Bottom 0.508: v21.5,64.7 22.8,63.4 v33.8,63.4 | v37.7,79.8 36.62,78.72 36.62,63.4 v36.52,63.3 v36.52,57.4 v36.52,36.5 36.52,30.08 37.1,29.5 43.5,29.5 45.25,27.75 DISPLAY.2
5V  (via drill 0.35)
  Top 0.508: U1.7 v18.09,30.19 C13.1 | U5.7 11.12,64.95 C18.1 11.2,66.2 11.7,66.7 16.4,66.7 17.3,67.6 17.3,69.11 18.25,70.06 U8.1 U8.6 18.25,77.38 C10.1 18.18,82.68 J2.2 | U3.7 25.82,65 C16.1 25.28,65.85 v25.58,65.55 | U9.1 32.41,65.49 31.8,66.1 31.8,68.2 31.31,68.69 C17.1 31.2,70.06 v31.2,70.8 | U4.7 36.62,27.07 C14.1 36.1,27.59 v36.1,28.3 | C15.1 25.32,49.6 v25.9,49.6 26.11,49.38 U2.7 | J7.2 47.86,51.56 v51.8,55.5 | v52.9,77.3 52.92,77.31 CR5.1 52.92,79.24 49.04,83.11 39.91,83.11 36.69,79.89 v36.59,79.89 | J6.2 49.94,72.4 v51.3,72.4
  Bottom 0.508: 25.3,70.7 23.7,70.7 17.86,76.54 J2.2 | 25.3,70.7 31.1,70.7 v31.2,70.8 31.2,73.8 J8.1 | 25.3,70.7 25.58,70.42 v25.58,65.55 | 35.5,29.4 35.5,28.9 v36.1,28.3 | 35.5,29.4 34.72,30.19 v18.09,30.19 | v25.9,49.6 33.9,49.6 35.5,51.2 | v51.8,55.5 52.9,56.6 v52.9,77.3 52.9,74 v51.3,72.4 | 35.5,29.4 35.5,51.2 | 35.5,51.2 35.5,71.7 J8.1 | v36.59,79.89 35.69,79 35.69,78.29 J8.1
-5V  (via drill 0.35)
  Top 0.508: U1.4 10.58,25.1 11.39,24.29 C23.1 12.05,25.25 v12,25.3 | U5.4 13.66,53.27 | 13.66,53.27 C22.1 | U4.4 28.74,22.68 29.46,21.95 C2.2 29.49,20.08 | C21.1 28.37,54.8 | 28.37,54.8 U3.4 | C20.1 U2.4 | 29.49,20.08 29.57,20.16 C24.1 | R4.2 29.49,20.08 | U8.2 19.2,68.41 C12.1 18.55,68.25 18.5,68.3 v18.5,69 | v14.9,54.5 13.66,53.27 | C21.1 | 28.37,54.8 v28.37,53.95
  Bottom 0.508: v18.5,69 18.5,57.5 | 18.5,57.5 20.4,59.4 20.4,58.1 | 18.5,57.5 15.5,54.5 v14.9,54.5 | 20.4,58.1 25.68,58.1 v28.37,53.95 | 20.4,58.1 20.4,45.7 | 20.4,45.7 20.4,37.7 12,29.3 v12,25.3 26.35,25.3 31.09,20.56 C24.1 | C20.1 27.45,38.65 20.4,45.7
  other vias: 31.09,20.16 28.68,38.65
AVG
  Top 0.508: C1.1 35.4,15.97 35.4,25.1 34.7,25.8 U4.6 31.89,25.8 31.4,26.3 31.4,28.9 29.8,30.5 26.8,30.5 | J1.1 25.23,30.5 26.8,30.5 | R6.2 25.17,28.87 26.8,30.5
CS
  Top 0.508: R66.2 58.08,27.4 DISPLAY.7 58.46,26.76 R29.2
D0
  Top 0.508: R20.2 47.66,27.14 DISPLAY.3
D1
  Top 0.508: DISPLAY.4 50.33,25.09 R21.2
DSP_RST  (via drill 0.35)
  Top 0.508: R22.1 52.96,20.64 53.8,19.8 62.7,19.8 65,22.1 v65,34.2
  Bottom 0.508: v65,34.2 65,34.15 X1.GP17
DSP_SCK  (via drill 0.35)
  Top 0.508: R20.1 47.66,20.77 50.23,18.2 63.3,18.2 66.6,21.5 66.6,39.18 v66.58,39.2
  Bottom 0.508: v66.58,39.2 66.55,39.23 X1.GP18
GAIN
  Top 0.508: J1.3 22.41,36 20.54,36 20.2,35.66 | U1.6 18.61,28.91 | 18.61,28.91 19.21,28.91 20.2,29.9 20.2,35.66 | R32.1 19.9,35.96 20.2,35.66 | R3.1 18.16,28.46 18.61,28.91
GALV2+
  Bottom 0.508: J8.3 32.3,84.9 33.3,85.9 41.9,85.9 50.5,77.3 50.5,42.4 49.5,41.4 J7.6
GALV_1+
  Bottom 0.508: J3.2 43.3,83 49.2,77.1 49.2,61.2 47.5,59.5 J6.6
GALV_2+
  Top 0.508: J8.2 30.36,77.44 29.59,78.21 J4.2
GALV_2-
  Top 0.508: J9.2 26.74,77.74 27.05,78.05 J4.1
GND  (via drill 0.35)
  Top 0.508: R2.1 12.86,34.94 14,33.8 18.2,33.8 18.5,33.5 18.5,32.7 C13.2 | C23.2 17.5,24.3 20.67,21.13 U7.2 | C4.1 20.96,40.67 R11.1 | C15.2 22.77,52.31 C5.1 | U9.2 34.01,66.44 34.46,66.89 33.96,67.39 U9.3 33.16,69.9 C17.2 | U8.5 19.2,74.3 19.98,75.08 C10.2 19.88,77.55 19.88,82.48 J2.1 | D4.1 54.95,71.65 v55.1,71.8
  Top 1.016: R27.1 5.14,18.75 5.59,18.3 MACHINE3.4 | MACHINE3.4 MACHINE3.1 | MACHINE3.5 MACHINE3.4
  Bottom 0.508: v55.1,71.8 58.09,74.79 X1.GND@8
  pour Top: 70.4,-4.1 70.4,88.7 -2.8,88.7 -2.8,-4.1
I_AVG  (via drill 0.35)
  Top 0.305: 37,54.3 37.5,54.3 v38.8,55.6 | v44.83,55.9 46.43,57.5 56.7,57.5 58.75,59.55 X1.GP27_A1
  Top 0.508: R28.1 14.6,64.7 14.83,64.93 D2.3 16.63,63.17 17,62.8 v21.5,62.8 | 37,54.3 33.8,54.3 v33.7,54.4
  Bottom 0.305: v38.8,55.6 38.85,55.65 44.58,55.65 v44.83,55.9
  Bottom 0.508: v33.7,54.4 33.7,54.7 26.3,62.1 22.2,62.1 v21.5,62.8
I_COMP
  Top 0.508: R30.1 33.8,61.4 34.65,60.55 D1.3 34.67,59.55 X1.GP6
I_GAIN  (via drill 0.35)
  Top 0.305: 36.65,34.15 v37.8,35.3
  Top 0.508: R31.1 29.37,32.13 33.29,32.13 33.49,32.33 D3.3 35.43,32.93 36.65,34.15
  Bottom 0.305: v37.8,35.3 38,35.5 52,35.5 57.1,40.6 57.1,55.8 58.31,57.01 X1.GP26_A0
IAVG
  Top 0.508: R18.2 12.09,59.59 12.39,59.9 | 12.39,59.9 U5.6 12.39,64.5 R28.2 | C9.2 15.56,59.6 12.69,59.6 12.39,59.9
ICOMP
  Top 0.508: U9.5 30.44,63.62 R25.1 30.72,61.42 R30.2
IFILT
  Top 0.508: 27.1,60.99 26.8,60.7 23.7,60.7 23.45,60.95 R12.2 19.58,60.95 R16.1 | 27.1,60.99 U3.6 26.94,62.64 R23.1 | C6.1 30.72,58.48 28.8,60.4 27.69,60.4 27.1,60.99
IGAIN
  Top 0.508: J1.2 23.81,34.46 R8.1 27.5,34.31 R31.2
MISO  (via drill 0.35)
  Top 0.508: R24.1 55.46,21.44 56.3,20.6 62.4,20.6 64.2,22.4 v64.2,44.4
  Bottom 0.508: v64.2,44.4 60.18,44.4 X1.GP20
MOSI  (via drill 0.35)
  Top 0.508: R21.1 50.46,21.96 53.42,19 63,19 65.8,21.8 v65.8,41.8
  Bottom 0.508: v65.8,41.8 65.77,41.77 X1.GP19
N$1
  Top 0.508: Q2.1 35.8,72.05 R34.1 R33.1
N$2
  Top 0.508: U1.2 8.52,30.19 8.2,30.5 8.2,32.9 8.8,33.5 9.7,33.5 9.89,33.69 R2.2 9.89,38.2 R1.1
N$3
  Top 0.508: J9.1 R37.2
N$4
  Top 0.508: U7.3 27.48,22.08 27.45,22.05 27.66,21.84 C2.1 27.69,20.02 R4.1 26.05,18.06 25.3,17.31 25.3,15.1 26.3,14.1 U10.3
N$5
  Top 0.508: C1.2 35.39,14.08 R5.1 31.73,14.08 30.79,13.15 U10.1
N$6
  Top 0.508: R37.1 26.9,72.7 Q2.3
N$7
  Top 0.508: R24.2 55.46,27.22 DISPLAY.6
N$8
  Top 0.508: R7.2 21.99,27.07 R6.1 U4.2
N$9
  Top 0.508: R8.2 29.15,36.63 R9.1 31.54,36.74 32.05,37.25 C3.1
N$10
  Top 0.508: C4.2 24.04,40.65 25.14,39.55 26.84,39.55 27.46,38.93 R9.2 27.46,42.41 U2.3
N$11
  Top 0.508: U2.2 26.11,43.78 25.5,44.4 21.32,44.4 R11.2 20.94,44.78 R10.1
N$12
  Top 0.508: C3.2 32.05,44.75 31.3,45.5 28,45.5 | 28,45.5 27.39,46.12 U2.6 27.39,50.3 R15.1 | R10.2 22.27,48.43 22.7,48 22.7,46.1 23.3,45.5 28,45.5
N$13
  Top 0.508: C6.2 31.55,52.75 31.06,52.26 R14.1 29.22,52.21 R15.2
N$14
  Top 0.508: U3.3 27.1,52.63 R14.2 24.62,52.26 C5.2
N$15
  Top 0.508: U3.2 25.82,58.77 25.45,59.15 R12.1 22.06,56.44 R13.2
N$16
  Top 0.508: R1.2 R1.3 15.42,37.5 15.01,37.09 R32.2
N$17
  Top 0.508: R17.2 15.3,57.36 14.8,57.86 12.81,57.86 12.39,57.44 U5.3 12.39,53.55 C8.1
N$18
  Top 0.508: R17.1 C9.1 17.85,59.19 R16.2
N$20
  Top 0.508: R19.2 R18.1 10.7,57.8 11.12,57.38 U5.2
N$21
  Top 0.508: R23.2 28.41,65.77 R26.2 | R26.2 30.19,67.64 U9.4 | C7.1 28.41,69.27 R26.2
N$22
  Top 0.508: U4.3 25.4,25.8 24.32,24.73 U7.1 24.32,25 23.73,25.6 R3.2
N$27
  Top 0.508: C11.1 22.04,71.06 U8.3
N$28
  Top 0.508: C11.2 22.09,73.44 U8.4
N$75
  Top 0.508: CR5.2 X1.VSYS
PWM_GALV
  Top 0.508: R33.2 37.75,72.25 X1.GP2
RST
  Top 0.508: DISPLAY.5 52.87,25.04 R22.2
SCL
  Top 0.508: J6.4 50.42,64.58 R36.2 54,64.1 D5.3
  Bottom 0.508: J7.4 45.8,48.38 45.8,64.58 J6.4 47.15,64.63 X1.GP5
SDA
  Top 0.508: D4.3 R35.2 47.48,67.4 J6.3 | J7.3 43.9,52.82 43.9,64.7 46.32,67.12 J6.3 | J6.3 42.36,67.12 X1.GP4
SS
  Top 0.508: R29.1 58.46,21.84 58.9,21.4 62,21.4 63.4,22.8 63.4,46.2 62.75,46.85 X1.GP21
V+
  Top 1.016: MACHINE3.6 5.3,5.6 2.3,8.6 2.3,78.4 4.8,80.9 10.2,80.9 J5.1
VIN-
  Top 0.508: U1.3 8.58,28.91 7.18,30.31 7.18,32.81 6.34,33.65 R27.2
  Top 1.016: R27.2 5.14,35.65 4.2,36.59 4.2,75.85 5.35,77 J5.2 J5.3

### Text on the board
tPlace: 5v | G2 | G1 | + | DAC | + | - | GND | - | + | - | + | PWM | 5v | CorrienteTestMaquina / v1-Nov'24